# Altium project Leonardo.PrjPcb
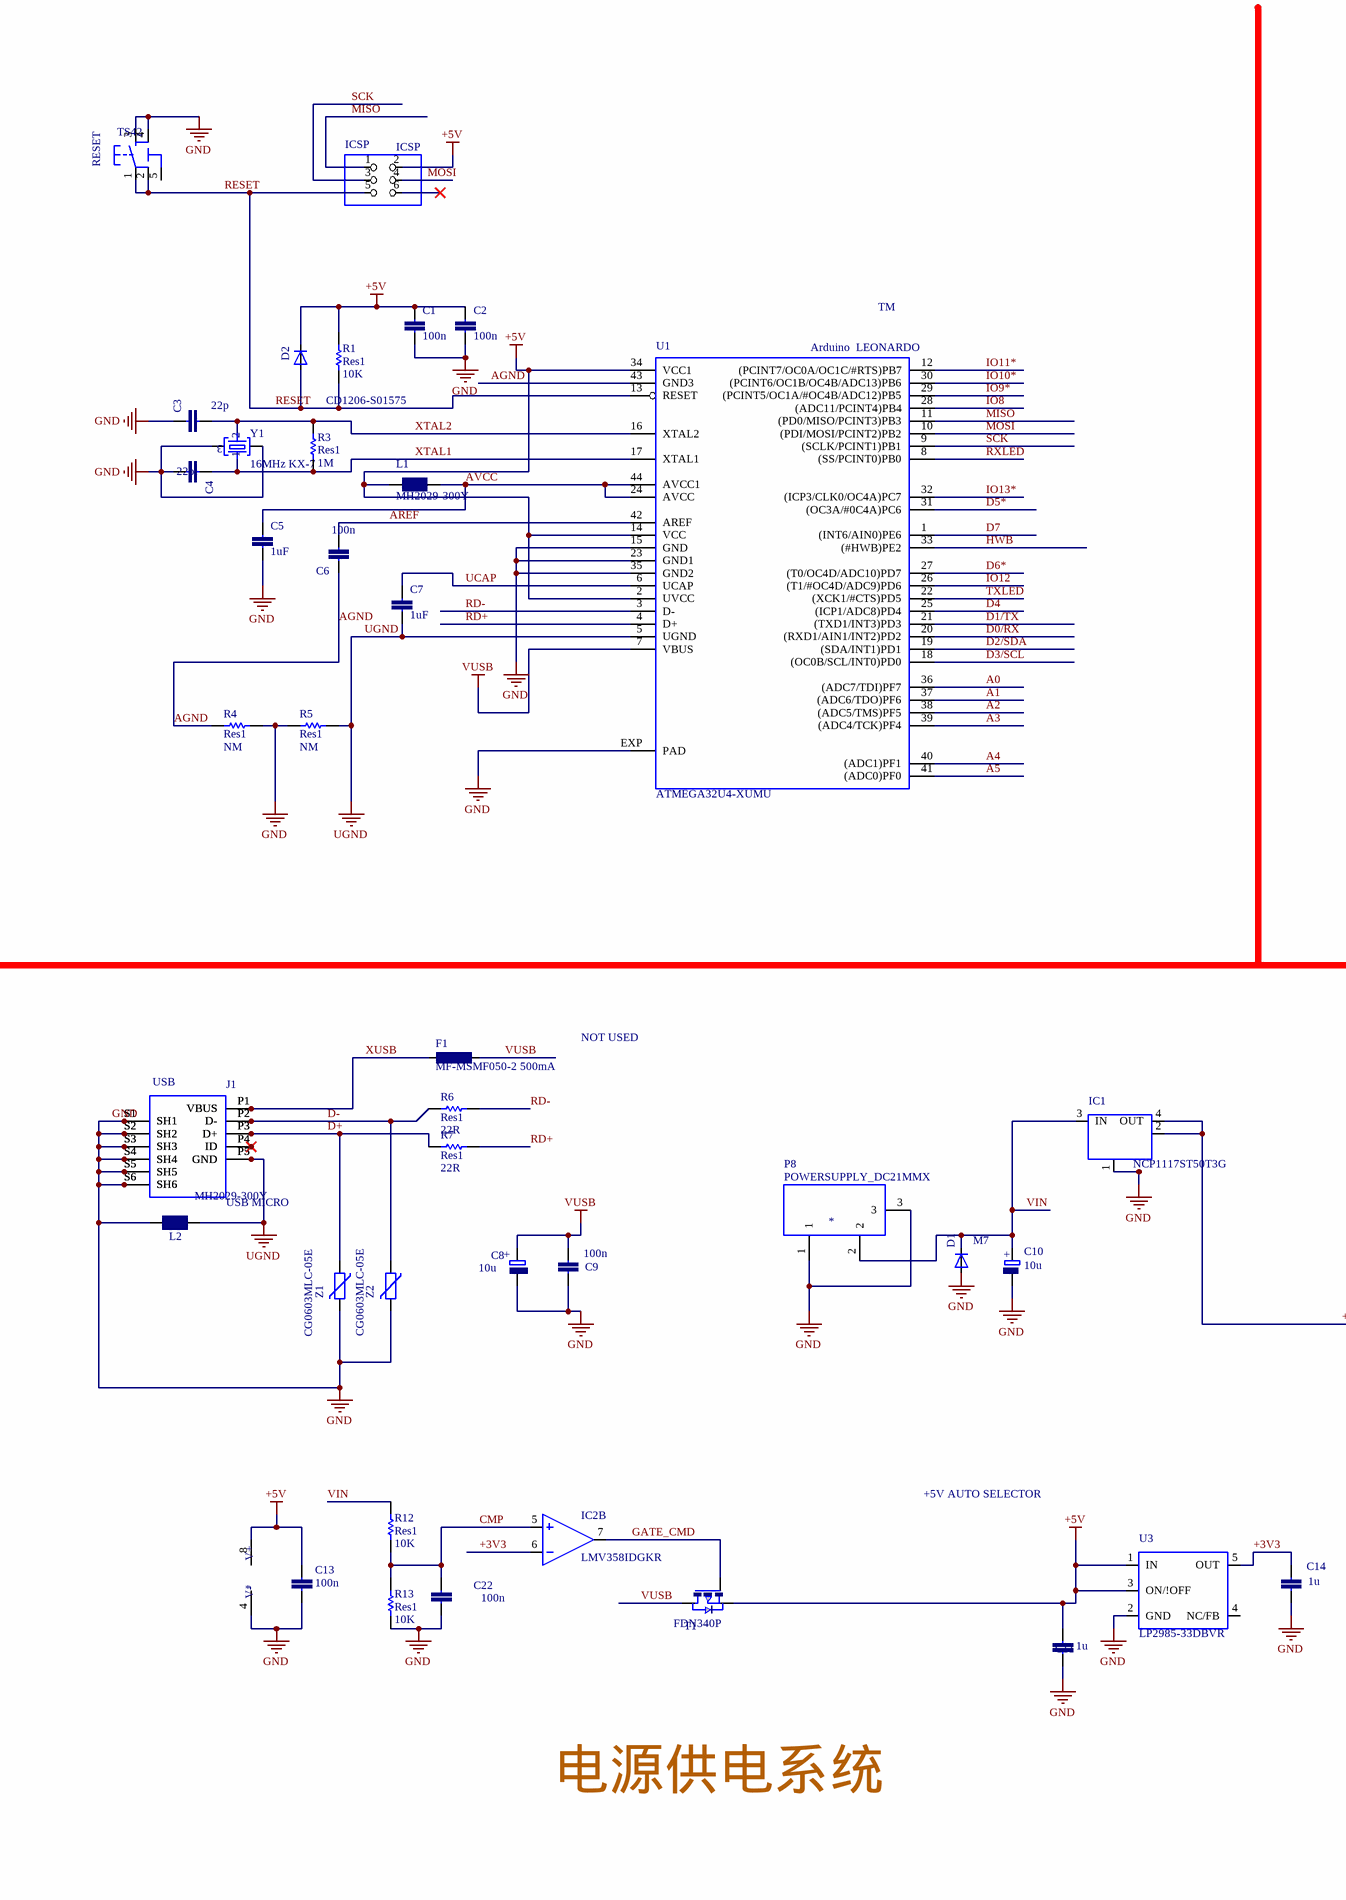
[diagram p0: 2Leonardo_PCB.SchDoc, left]
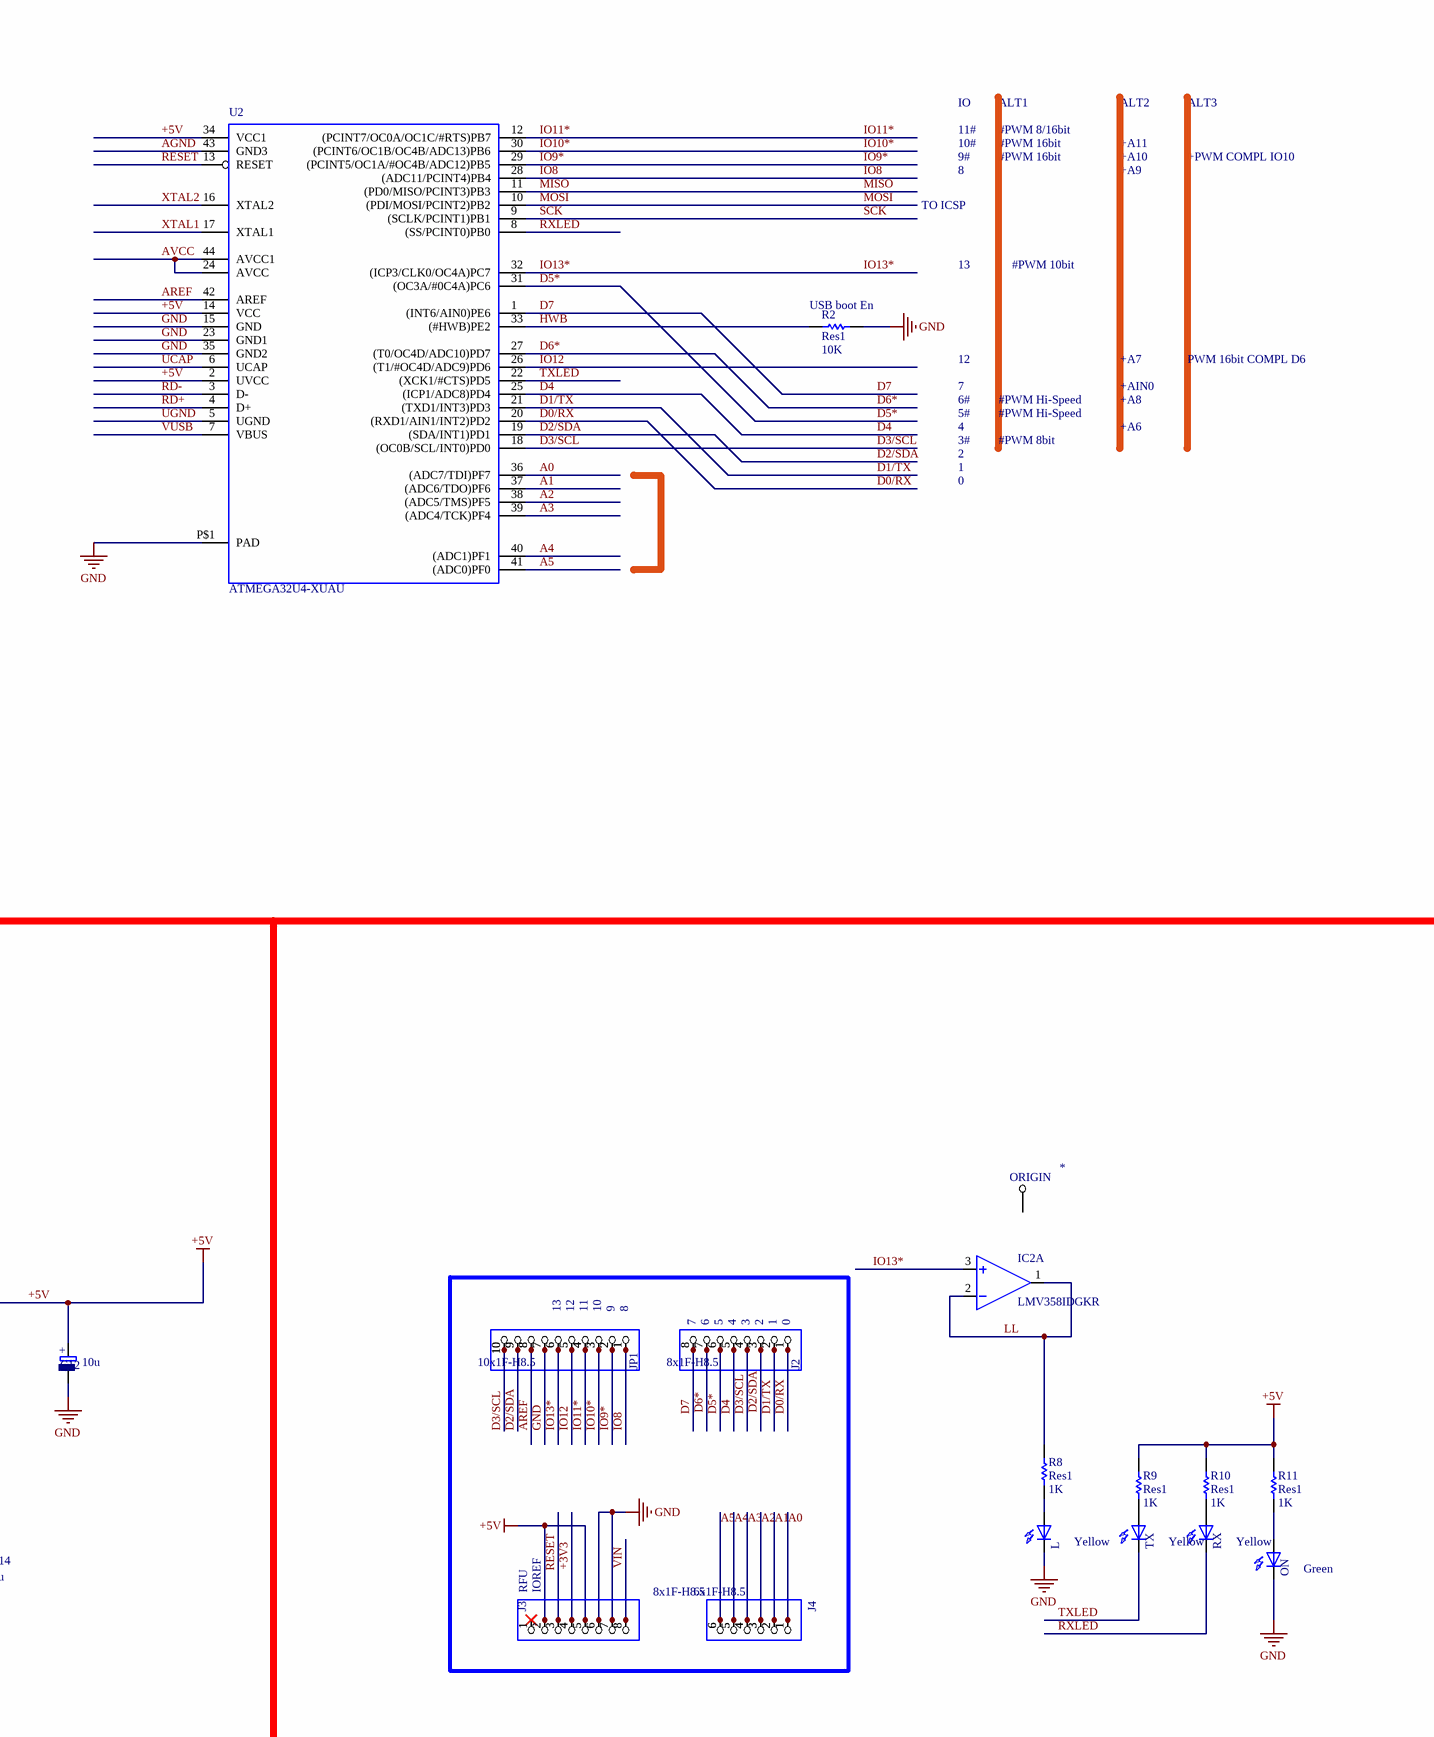
[diagram p1: 2Leonardo_PCB.SchDoc, right]
1 sheet, 55 parts. Net scope: global (net labels, ports and power ports of the same name join across sheets).
Board file: Leonardo.PcbDoc

## Sheet 2Leonardo_PCB.SchDoc
size A2

### Parts
C1  100n  [C0603-ROUND]
C2  100n  [C0603-ROUND]
C3  22p  [C0603-ROUND]
C4  22p  [C0603-ROUND]
C5  1uF  [C0603-ROUND]
C6  100n  [C0603-ROUND]
C7  1uF  [C0603-ROUND]
C8  10u  [SMC_B]
C9  100n  [C0603-ROUND]
C10  10u  [SMC_B]
C11  1u  [C0603-ROUND]
C12  10u  [SMC_B]
C13  100n  [C0603-ROUND]
C14  1u  [C0603-ROUND]
C22  100n  [C0603-ROUND]
D1  M7  [SMB]
D2  CD1206-S01575  [MINIMELF]
F1  MF-MSMF050-2 500mA  [L1812]
IC1  NCP1117ST50T3G  [SOT223]
IC2  LMV358IDGKR  [MSOP08]  (parts A,B,C of 3)
ICSP  ICSP  [2X03]
J1  USB MICRO  [CON2_USB_MICRO_B_AT]
J2  8x1F-H8.5  [1X08]
J3  8x1F-H8.5  [1X08]
J4  6x1F-H8.5  [1X06]
JP1  10x1F-H8.5  [1X10]
L  Yellow  [CHIPLED_0805]
L1  MH2029-300Y  [0805]
L2  MH2029-300Y  [0805]
ON  Green  [CHIPLED_0805]
ORIGIN  *  [FIDUCIA-MOUNT]
P8  *  [POWERSUPPLY_DC-21MM]
R1  Res1  value 10K  [R0603-ROUND]
R2  Res1  value 10K  [R0603-ROUND]
R3  Res1  value 1M  [R0603-ROUND]
R4  Res1  value NM  [R0603-ROUND]
R5  Res1  value NM  [R0603-ROUND]
R6  Res1  value 22R  [R0603-ROUND]
R7  Res1  value 22R  [R0603-ROUND]
R8  Res1  value 1K  [R0603-ROUND]
R9  Res1  value 1K  [R0603-ROUND]
R10  Res1  value 1K  [R0603-ROUND]
R11  Res1  value 1K  [R0603-ROUND]
R12  Res1  value 10K  [R0603-ROUND]
R13  Res1  value 10K  [R0603-ROUND]
RESET  TS42  [TS42]
RX  Yellow  [CHIPLED_0805]
T1  FDN340P  [SOT-23]
TX  Yellow  [CHIPLED_0805]
U1  ATMEGA32U4-XUMU  [QFN44ML7X7]
U2  ATMEGA32U4-XUAU  [TQFP44-PAD]
U3  LP2985-33DBVR  [SOT23-DBV]
Y1  16MHz KX-7  [CRYSTAL-3.2-2.5]
Z1  CG0603MLC-05E  [CT/CN0603]
Z2  CG0603MLC-05E  [CT/CN0603]

### Nets
+5V: C1.1 C2.1 C11.2 C12.+ C13.1 D2.C IC1.2(OUT@1) IC1.4(OUT) IC2.8(V+) ICSP.2 J3.2 J3.5 L1.1 R1.2 R9.2 R10.2 R11.2 T1.2(S) U1.2(UVCC) U1.14(VCC) U1.34(VCC1) U2.2(UVCC) U2.14(VCC) U2.34(VCC1) U3.1(IN) U3.3(ON/!OFF)
GND: C1.2 C2.2 C3.1 C4.2 C5.2 C8.- C9.1 C10.- C11.1 C12.- C13.2 C14.1 C22.1 D1.A IC1.1(GND/ADJ) IC2.4(V-) J1.S1(SH1) J1.S2(SH2) J1.S3(SH3) J1.S4(SH4) J1.S5(SH5) J1.S6(SH6) J3.6 J3.7 JP1.7 L.C L2.2 ON.C P8.1 P8.3 R2.1 R4.2 R5.1 R13.1 RESET.3 RESET.4 U1.15(GND) U1.23(GND1) U1.35(GND2) U1.EXP(PAD) U2.15(GND) U2.23(GND1) U2.35(GND2) U2.P$1(PAD) U3.2(GND) Y1.2(GND@1) Y1.4(GND@2) Z1.2 Z2.2
UGND: C7.2 J1.P5(GND) L2.1 R5.2 U1.5(UGND) U2.5(UGND)
VUSB: C8.+ C9.2 F1.1 T1.1(D) U1.7(VBUS) U2.7(VBUS)
+3V3: C14.2 IC2.6(-IN) J3.4 U3.5(OUT)
A0: J4.1 U1.36((ADC7/TDI)PF7) U2.36((ADC7/TDI)PF7)
A1: J4.2 U1.37((ADC6/TDO)PF6) U2.37((ADC6/TDO)PF6)
A2: J4.3 U1.38((ADC5/TMS)PF5) U2.38((ADC5/TMS)PF5)
A3: J4.4 U1.39((ADC4/TCK)PF4) U2.39((ADC4/TCK)PF4)
A4: J4.5 U1.40((ADC1)PF1) U2.40((ADC1)PF1)
A5: J4.6 U1.41((ADC0)PF0) U2.41((ADC0)PF0)
AGND: C6.1 R4.1 U1.43(GND3) U2.43(GND3)
AREF: C6.2 JP1.8 U1.42(AREF) U2.42(AREF)
AVCC: C5.1 L1.2 U1.24(AVCC) U1.44(AVCC1) U2.24(AVCC) U2.44(AVCC1)
CMP: C22.2 IC2.5(+IN) R12.1 R13.2
D0/RX: J2.1 U1.20((RXD1/AIN1/INT2)PD2) U2.20((RXD1/AIN1/INT2)PD2)
D1/TX: J2.2 U1.21((TXD1/INT3)PD3) U2.21((TXD1/INT3)PD3)
D2/SDA: J2.3 JP1.9 U1.19((SDA/INT1)PD1) U2.19((SDA/INT1)PD1)
D3/SCL: J2.4 JP1.10 U1.18((OC0B/SCL/INT0)PD0) U2.18((OC0B/SCL/INT0)PD0)
D4: J2.5 U1.25((ICP1/ADC8)PD4) U2.25((ICP1/ADC8)PD4)
D5*: J2.6 U1.31((OC3A/#0C4A)PC6) U2.31((OC3A/#0C4A)PC6)
D6*: J2.7 U1.27((T0/OC4D/ADC10)PD7) U2.27((T0/OC4D/ADC10)PD7)
D7: J2.8 U1.1((INT6/AIN0)PE6) U2.1((INT6/AIN0)PE6)
D+: J1.P3(D+) R7.1 Z1.1
D-: J1.P2(D-) R6.1 Z2.1
GATE_CMD: IC2.7(OUT) T1.3(G)
HWB: R2.2 U1.33((#HWB)PE2) U2.33((#HWB)PE2)
IO8: JP1.1 U1.28((ADC11/PCINT4)PB4) U2.28((ADC11/PCINT4)PB4)
IO9*: JP1.2 U1.29((PCINT5/OC1A/#OC4B/ADC12)PB5) U2.29((PCINT5/OC1A/#OC4B/ADC12)PB5)
IO10*: JP1.3 U1.30((PCINT6/OC1B/OC4B/ADC13)PB6) U2.30((PCINT6/OC1B/OC4B/ADC13)PB6)
IO11*: JP1.4 U1.12((PCINT7/OC0A/OC1C/#RTS)PB7) U2.12((PCINT7/OC0A/OC1C/#RTS)PB7)
IO12: JP1.5 U1.26((T1/#OC4D/ADC9)PD6) U2.26((T1/#OC4D/ADC9)PD6)
IO13*: IC2.3(+IN) JP1.6 U1.32((ICP3/CLK0/OC4A)PC7) U2.32((ICP3/CLK0/OC4A)PC7)
LL: IC2.1(OUT) IC2.2(-IN) R8.2
MISO: ICSP.1 U1.11((PD0/MISO/PCINT3)PB3) U2.11((PD0/MISO/PCINT3)PB3)
MOSI: ICSP.4 U1.10((PDI/MOSI/PCINT2)PB2) U2.10((PDI/MOSI/PCINT2)PB2)
RD+: R7.2 U1.4(D+) U2.4(D+)
RD-: R6.2 U1.3(D-) U2.3(D-)
RESET: D2.A ICSP.5 J3.3 R1.1 RESET.1 RESET.2 U1.13(RESET) U2.13(RESET)
RXLED: RX.C U1.8((SS/PCINT0)PB0) U2.8((SS/PCINT0)PB0)
SCK: ICSP.3 U1.9((SCLK/PCINT1)PB1) U2.9((SCLK/PCINT1)PB1)
TXLED: TX.C U1.22((XCK1/#CTS)PD5) U2.22((XCK1/#CTS)PD5)
UCAP: C7.1 U1.6(UCAP) U2.6(UCAP)
VIN: C10.+ D1.C IC1.3(IN) J3.8 P8.2 R12.2
XTAL1: C4.1 R3.1 U1.17(XTAL1) U2.17(XTAL1) Y1.1(C1)
XTAL2: C3.2 R3.2 U1.16(XTAL2) U2.16(XTAL2) Y1.3(C2)
XUSB: F1.2 J1.P1(VBUS)
NetL_A: L.A R8.1
NetON_A: ON.A R11.1
NetR9_1: R9.1 TX.A
NetR10_1: R10.1 RX.A

Not connected (* = marked no-connect by the designer): ICSP 6*; J1 P4(ID)*; J3 1*; ORIGIN X(TESTP); RESET 5(5-GND); U3 4(NC/FB)

### Notes on the sheet
- IO
- ALT1
- ALT2
- ALT3
- 11#
- 10#
- 9#
- 8
- #PWM 8/16bit
- #PWM 16bit
- +A11
- +A10
- +A9
- +PWM COMPL IO10
- TM
- TO ICSP
- (near U1) Arduino  LEONARDO
- (near R2) USB boot En
- 13
- #PWM 10bit
- 12
- +A7
- PWM 16bit COMPL D6
- 7
- 6#
- 5#
- 4
- 3#
- #PWM Hi-Speed
- #PWM 8bit
- +AIN0
- +A8
- +A6
- 2
- 1
- 0
- (near J1) USB
- NOT USED
- (near JP1) 13
- (near JP1) 12
- (near JP1) 11
- (near JP1) 10
- (near JP1) 9
- (near JP1) 8
- (near J2) 7
- (near J2) 6
- (near J2) 5
- (near J2) 4
- (near J2) 3
- (near J2) 2
- (near J2) 1
- (near J2) 0
- +5V AUTO SELECTOR
- (near J3) RFU
- (near J3) IOREF
- 电源供电系统

### Library data of the parts
C1-C7 C9 C11 C13 C14 C22 = C-EUC0603
C8 C10 C12 = CPOL-EUSMCB
D1 = DIODE-SMB
D2 = DIODE-MINIMELF
F1 = L-EUL1812
IC1 = MC33269ST-3.3T3
IC2 = LMV358MMX
ICSP = PINHD-2X3
J1 = MYCON2_USB-MINI-B
J2 J3 = PINHD-1X8
J4 = PINHD-1X6
JP1 = PINHD-1X10
L ON RX TX = LEDCHIPLED_0805
L1 L2 = WE-CBF_0805
ORIGIN = TP_SP
P8 = POWERSUPPLY_DC21MMX
R1-R13 = Res1: Resistor; Published: 8-Jun-2000; LatestRevisionDate: 17-Jul-2002; LatestRevisionNote: Re-released for DXP Platform.; PackageReference: AXIAL-0.3; Publisher: Altium Limited; PackageDescription: Axial Device, Thru-Hole; 2 Leads; 0.3 in Pin Spacing
T1 = PMOSSOT23
U3 = LP2985-XXDBVR33
Y1 = CRYSTAL-3.2-2.5
Z1 Z2 = VARISTORCN0603